# EAGLE design drive_brake (EAGLE 9.5.1)
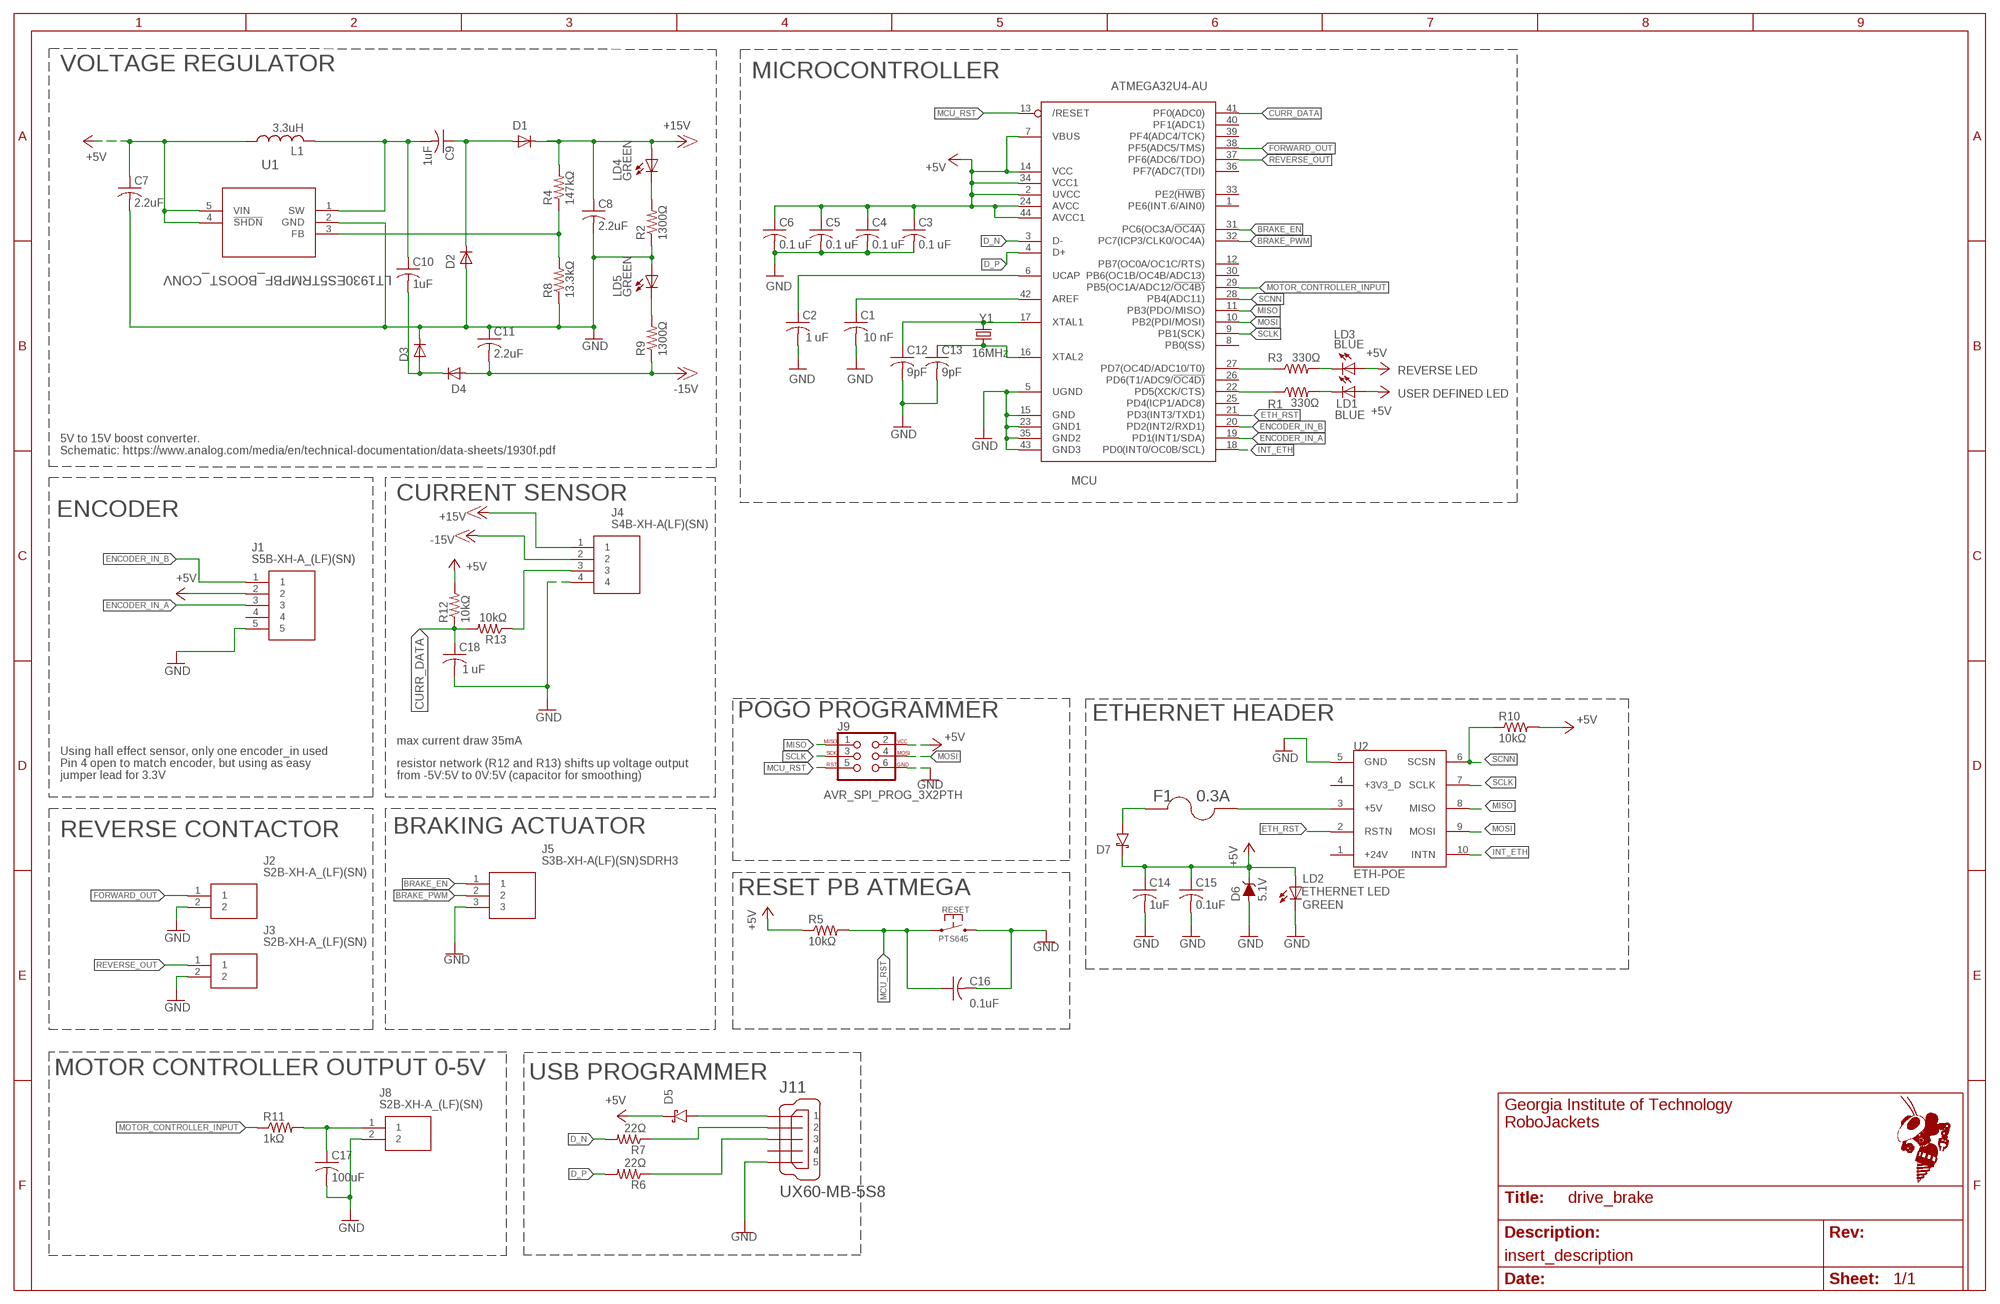
[diagram p0: schematic, sheet 1]
FRAME1 (FRAME_B_L): SCH_DESC: insert_description

## Parts
C1  10 nF  C-USC0603  [C0603]
C2  1 uF  C-USC0603  [C0603]
C3  0.1 uF  C-USC0603  [C0603]
C4  0.1 uF  C-USC0603  [C0603]
C5  0.1 uF  C-USC0603  [C0603]
C6  0.1 uF  C-USC0603  [C0603]
C7  2.2uF  C-USC0805  [C0805]
C8  2.2uF  C-USC1206  [C1206]
C9  1uF  C-USC0603  [C0603]
C10  1uF  C-USC0603  [C0603]
C11  2.2uF  C-USC1206  [C1206]
C12  9pF  C-USC0603  [C0603]
C13  9pF  C-USC0603  [C0603]
C14  1uF  C-USC0603  [C0603]
C15  0.1uF  C-USC0603  [C0603]
C16  0.1uF  C-USC0603  [C0603]
C17  100uF  C-USC1206  [C1206]
C18  1 uF  C-USC0603  [C0603]
D1  DIODE-SOD123  [SOD123]
D2  DIODE-SOD123  [SOD123]
D3  DIODE-SOD123  [SOD123]
D4  DIODE-SOD123  [SOD123]
D5  SCHOTTKYSOD-323  [SOD-323]
D6  5.1V  DIODE-ZENER-MM3Z3V3T1G  [SOD-323]
D7  SCHOTTKYSOD-323  [SOD-323]
F1  0.3A  FUSE1206  [F1206]
J1  S5B-XH-A_(LF)(SN)  [SHDR5W80P0X250_1X5_1490X1150X6]
J2  S2B-XH-A_(LF)(SN)  [SHDR2W80P0X250_1X2_740X1150X61]
J3  S2B-XH-A_(LF)(SN)  [SHDR2W80P0X250_1X2_740X1150X61]
J4  S4B-XH-A(LF)(SN)  [SHDR4W64P0X250_1X4_1240X1155X7]
J5  S3B-XH-A(LF)(SN)SDRH3  [SHDR4]
J8  S2B-XH-A_(LF)(SN)  [SHDR2W80P0X250_1X2_740X1150X61]
J9  AVR_SPI_PROG_3X2PTH  [2X3]
J11  UX60-MB-5S8  [UX60-MB-5S8]
L1  3.3uH  L-USL3225M  [L3225M]
LD1  BLUE  LED0603  [LED-0603]
LD2  GREEN  LED0603  [LED-0603]
LD3  BLUE  LED0603  [LED-0603]
LD4  GREEN  LED0603  [LED-0603]
LD5  GREEN  LED0603  [LED-0603]
MCU  ATMEGA32U4-AU  [TQFP44]
R1  330Ω  RESISTOR0603-RES  [0603-RES]
R2  1300Ω  R-US_R0603  [R0603]
R3  330Ω  RESISTOR0603-RES  [0603-RES]
R4  147kΩ  R-US_R0603  [R0603]
R5  10kΩ  R-US_R0603  [R0603]
R6  22Ω  RESISTOR0603-RES  [0603-RES]
R7  22Ω  RESISTOR0603-RES  [0603-RES]
R8  13.3kΩ  R-US_R0603  [R0603]
R9  1300Ω  R-US_R0603  [R0603]
R10  10kΩ  R-US_R0603  [R0603]
R11  1kΩ  RESISTOR0603-RES  [0603-RES]
R12  10kΩ  RESISTOR0603-RES  [0603-RES]
R13  10kΩ  RESISTOR0603-RES  [0603-RES]
RESET  PTS645  [PTS645]
U1  LT1930ES5TRMPBF_BOOST_CONV  [SOT-5_S]
U2  ETH-POE  [HDRVR10W64P4000X254_2X5_1016X508X254B]
Y1  16MHz  CRYSTAL5X3  [CRYSTAL-SMD-5X3]

## Nets
+5V [vcc]: C3.1 C4.1 C5.1 C6.1 C7.1 C14.1 C15.1 D5.C D6.C D7.C J1.2 J9.2 L1.1 LD1.A LD2.A LD3.A MCU.2(UVCC) MCU.7(VBUS) MCU.14(VCC) MCU.24(AVCC) MCU.34(VCC1) MCU.44(AVCC1) R5.1 R10.2 R12.2 U1.4(!SHDN) U1.5(VIN)
+15V [vcc]: C8.1 D1.C J4.1 LD4.A R4.2
-15V [vcc]: C11.2 D4.A J4.2 R9.1
BRAKE_EN [data]: J5.1 MCU.31(PC6(OC3A/!OC4A))
BRAKE_PWM [data]: J5.2 MCU.32(PC7(ICP3/CLK0/OC4A))
CURR_DATA [data]: C18.1 MCU.41(PF0(ADC0)) R12.1 R13.2
CURR_RAW [data]: J4.3 R13.1
D_N [diff_pair]: MCU.3(D-) R7.2
D_P [diff_pair]: MCU.4(D+) R6.2
ENCODER_IN_A [data]: J1.3 MCU.19(PD1(INT1/SDA))
ENCODER_IN_B [data]: J1.1 MCU.20(PD2(INT2/RXD1))
ETH_RST [data]: MCU.21(PD3(INT3/TXD1)) U2.2(RSTN)
FORWARD_OUT [data]: J2.1 MCU.38(PF5(ADC5/TMS))
GND: C1.2 C2.2 C3.2 C4.2 C5.2 C6.2 C7.2 C8.2 C11.1 C12.2 C13.2 C14.2 C15.2 C16.2 C17.2 C18.2 D2.A D3.C D6.A J1.5 J2.2 J3.2 J4.4 J5.3 J8.2 J9.6 J11.5 LD2.C LD5.A MCU.5(UGND) MCU.15(GND) MCU.23(GND1) MCU.35(GND2) MCU.43(GND3) R2.1 R8.1 RESET.P$3 RESET.P$4 U1.2(GND) U2.5(GND)
INT_ETH [data]: MCU.18(PD0(INT0/OC0B/SCL)) U2.10(INTN)
MCU_RST [data]: C16.1 J9.5 MCU.13(/RESET) R5.2 RESET.P$1 RESET.P$2
MISO [data]: J9.1 MCU.11(PB3(PDO/MISO)) U2.8(MISO)
MOSI [data]: J9.4 MCU.10(PB2(PDI/MOSI)) U2.9(MOSI)
MOTOR_CONTROLLER_INPUT [data]: MCU.29(PB5(OC1A/ADC12/!OC4B)) R11.1
N$1: C1.1 MCU.42(AREF)
N$2: C2.1 MCU.6(UCAP)
N$3: LD3.C R3.2
N$4: F1.2 U2.3(+5V)
N$5: R4.1 R8.2 U1.3(FB)
N$6: C9.2 C10.1 L1.2 U1.1(SW)
N$7: LD1.C R1.2
N$8: C10.2 D3.A D4.C
N$9: D5.A J11.1
N$10: D7.A F1.1
N$11: J11.2 R7.1
N$12: J11.3 R6.1
N$13: C13.1 MCU.16(XTAL2) Y1.1
N$14: LD4.C R2.2
N$15: C12.1 MCU.17(XTAL1) Y1.3
N$16: C9.1 D1.A D2.C
N$17: LD5.C R9.2
N$18: C17.1 J8.1 R11.2
REVERSE_OUT [data]: J3.1 MCU.37(PF6(ADC6/TDO))
SCLK [data]: J9.3 MCU.9(PB1(SCK)) U2.7(SCLK)
SCNN [data]: MCU.28(PB4(ADC11)) R10.1 U2.6(SCSN)
TXLED [data]: MCU.22(PD5(XCK/CTS)) R1.1
TXLED1 [data]: MCU.27(PD7(OC4D/ADC10/T0)) R3.1
Unconnected: J1.4 J11.4 MCU.1(PE6(INT.6/AIN0)) MCU.8(PB0(SS)) MCU.12(PB7(OC0A/OC1C/RTS)) MCU.25(PD4(ICP1/ADC8)) MCU.26(PD6(T1/ADC9/!OC4D)) MCU.30(PB6(OC1B/OC4B/ADC13)) MCU.33(PE2(!HWB)) MCU.36(PF7(ADC7(TDI)) MCU.39(PF4(ADC4/TCK)) MCU.40(PF1(ADC1)) U2.1(+24V) U2.4(+3V3_D)

## Notes on the sheet
- VOLTAGE REGULATOR
- MICROCONTROLLER
- REVERSE LED
- USER DEFINED LED
- 5V to 15V boost converter. 
  Schematic: https://www.analog.com/media/en/technical-documentation/data-sheets/1930f.pdf
- CURRENT SENSOR
- ENCODER
- POGO PROGRAMMER | ETHERNET HEADER
- max current draw 35mA
- Using hall effect sensor, only one encoder_in used
  Pin 4 open to match encoder, but using as easy
  jumper lead for 3.3V
- resistor network (R12 and R13) shifts up voltage output
  from -5V:5V to 0V:5V (capacitor for smoothing)
- REVERSE CONTACTOR | BRAKING ACTUATOR
- RESET PB ATMEGA | ETHERNET LED
- MOTOR CONTROLLER OUTPUT 0-5V | USB PROGRAMMER

## Library data of the parts
C1-C6 C12-C18 = rcl:C-US: CAPACITOR, American symbol; SPICEPREFIX: C
C7 = rcl:C-US: CAPACITOR, American symbol; DKPT: 587-5919-1-ND; SPICEPREFIX: C
C8 C11 = rcl:C-US: CAPACITOR, American symbol; DKPT: 587-5840-1-ND; SPICEPREFIX: C
C9 C10 = rcl:C-US: CAPACITOR, American symbol; DKPT: 311-1445-1-ND; SPICEPREFIX: C
D1-D4 = RoboJackets-Diodes:DIODE-: DIODE; DKPT: MBR0520TPMSCT-ND
D5 = RoboJackets-Diodes:SCHOTTKY; DKPT: B0520WS-FDICT-ND
D6 = SparkFun-DiscreteSemi:DIODE-ZENER: Zener Diode A Zener diode allows current to flow from its anode to its cathode like a normal semiconductor diode, but it also permits current to flow in the reverse direction when its "Zener voltage" is reached. - WIkipedia; PROD_ID: DIO-11284; VALUE: 3.3V
D7 = RoboJackets-Diodes:SCHOTTKY; DKPT: MBRX0520TPMSCT-ND
F1 = RoboJackets-Passive:FUSE; DKPT: F10984CT-ND
J1 = drive_brake:S5B-XH-A_(LF)(SN): JST XH Series, 2.5mm Pitch 5 Way 1 Row Right Angle PCB Header, Through Hole, Solder Termination Source: Datasheet <http://www.jst-mfg.com/product/pdf/eng/eXH.pdf>; DESCRIPTION: JST XH Series, 2.5mm Pitch 5 Way 1 Row Right Angle PCB Header, Through Hole, Solder Termination; HEIGHT: 6.1mm; MANUFACTURER_NAME: JST (JAPAN SOLDERLESS TERMINALS); MANUFACTURER_PART_NUMBER: S5B-XH-A (LF)(SN); RS_PART_NUMBER: 5469072; RS_PRICE-STOCK: http://uk.rs-online.com/web/p/products/5469072
J2 J3 J8 = drive_brake:S2B-XH-A_(LF)(SN): JST (JAPAN SOLDERLESS TERMINALS) - S2B-XH-A (LF)(SN) - CONNECTOR, HEADER, THT, R/A, 2.5MM, 2WAY Source: Datasheet <http://www.jst-mfg.com/product/pdf/eng/eXH.pdf>; DESCRIPTION: JST (JAPAN SOLDERLESS TERMINALS) - S2B-XH-A (LF)(SN) - CONNECTOR, HEADER, THT, R/A, 2.5MM, 2WAY; HEIGHT: 6.1mm; MANUFACTURER_NAME: JST (JAPAN SOLDERLESS TERMINALS); MANUFACTURER_PART_NUMBER: S2B-XH-A (LF)(SN)
J4 = drive_brake:S4B-XH-A(LF)(SN): XH-2.5mm Header side entry 4 way JST XH Series, Series Number S4B, 2.5mm Pitch 4 Way 1 Row Right Angle PCB Header, Solder Termination, 3A Source: Datasheet <http://www.jst-mfg.com/product/pdf/eng/eXH.pdf>; DESCRIPTION: XH-2.5mm Header side entry 4 way JST XH Series, Series Number S4B, 2.5mm Pitch 4 Way 1 Row Right Angle PCB Header, Solder Termination, 3A; HEIGHT: 7mm; MANUFACTURER_NAME: JST (JAPAN SOLDERLESS TERMINALS); MANUFACTURER_PART_NUMBER: S4B-XH-A(LF)(SN); RS_PART_NUMBER: 8201589P; RS_PRICE-STOCK: http://uk.rs-online.com/web/p/products/8201589P
J5 = drive_brake:S3B-XH-A(LF)(SN): XH-2.5mm Header side entry 3 way JST XH Series, Series Number S3B, 2.5mm Pitch 3 Way 1 Row Right Angle PCB Header, Solder Termination, 3A Source: Datasheet <http://www.jst-mfg.com/product/pdf/eng/eXH.pdf>
J9 = SparkFun-Connectors:AVR_SPI_PROG_3X2: AVR ISP 6 Pin This is the reduced ISP connector for AVR programming. Common on Arduino. This footprint will take up less PCB space and can be used with a 10-pin to 6-pin adapter such as SKU: BOB-08508 **Special note about "TEST_POINT" package. The stop mask is on the top side, so if you want your programming test points to be on the bottom of your board, make sure to place this package on the bottom side of the board. This also ensure that the orientation to program from the bottom side will be correct. SparkFun Products: SparkFun ISP Pogo Adapter <https://www.sparkfun.com/products/11591> - NS Tiny AVR Programmer <https://www.sparkfun.com/products/11801> -PTH
J11 = RoboJackets-Connectors:UX60*-MB-5S?: Mini USB Connector Brand: Hirose Electric Co Ltd <http://www.hirose.com/us/> Series: UX <http://www.digikey.com/product-search/en?FV=fff40016,fff802e4,ffec3225> Distributor: Digi-Key <http://www.digikey.com/product-detail/en/UX60A-MB-5ST/H2961CT-ND/597540>; PINS: 5
L1 = rcl:L-US: INDUCTOR, American symbol; DKPT: 535-12564-1-ND; SPICEPREFIX: L
LD1-LD3 = SparkFun:LED: LEDs Standard schematic elements and footprints for 5mm, 3mm, 1206, and 0603 sized LEDs. 5mm - Spark Fun Electronics SKU : COM-00529 (and others)
LD4 LD5 = SparkFun:LED: LEDs Standard schematic elements and footprints for 5mm, 3mm, 1206, and 0603 sized LEDs. 5mm - Spark Fun Electronics SKU : COM-00529 (and others); DKPT: 160-1446-1-ND
MCU = adafruit:ATMEGA32U4: http://www.ladyada.net/library/eagle
R1 R3 R12 R13 = SparkFun:RESISTOR: Resistor Basic schematic elements and footprints for 0603, 1206, and PTH resistors.
R2 R9 = rcl:R-US_: RESISTOR, American symbol; DKPT: RR08P1.3KDCT-ND; SPICEPREFIX: R
R4 = rcl:R-US_: RESISTOR, American symbol; DKPT: 311-147KHRCT-ND; SPICEPREFIX: R
R5 R10 = rcl:R-US_: RESISTOR, American symbol; SPICEPREFIX: R
R6 R7 R11 = SparkFun:RESISTOR: Resistor Basic schematic elements and footprints for 0603, 1206, and PTH resistors.; DKPT: 118-CR0603-FX-22R0ELFCT-ND
R8 = rcl:R-US_: RESISTOR, American symbol; DKPT: RR08P13.3KDCT-ND; SPICEPREFIX: R
RESET = RoboJackets-Switches:PTS645
U1 = drive_brake:LT1930ES5TRMPBF_BOOST_CONV; MANUFACTURER_PART_NUMBER: LT1930ES5#TRMPBF; VENDOR: Linear Technology
U2 = ethernet_poe:ETH-POE: POE
Y1 = SparkFun:CRYSTAL: Crystals Various standard crystals. Proven footprints. Spark Fun Electronics SKU : COM-00534

## Net classes
0 default: width 0.25 mm, drill 0.35 mm
1 vcc: width 0.3 mm
2 diff_pair: width 0.25 mm
3 data: width 0.25 mm

## Board
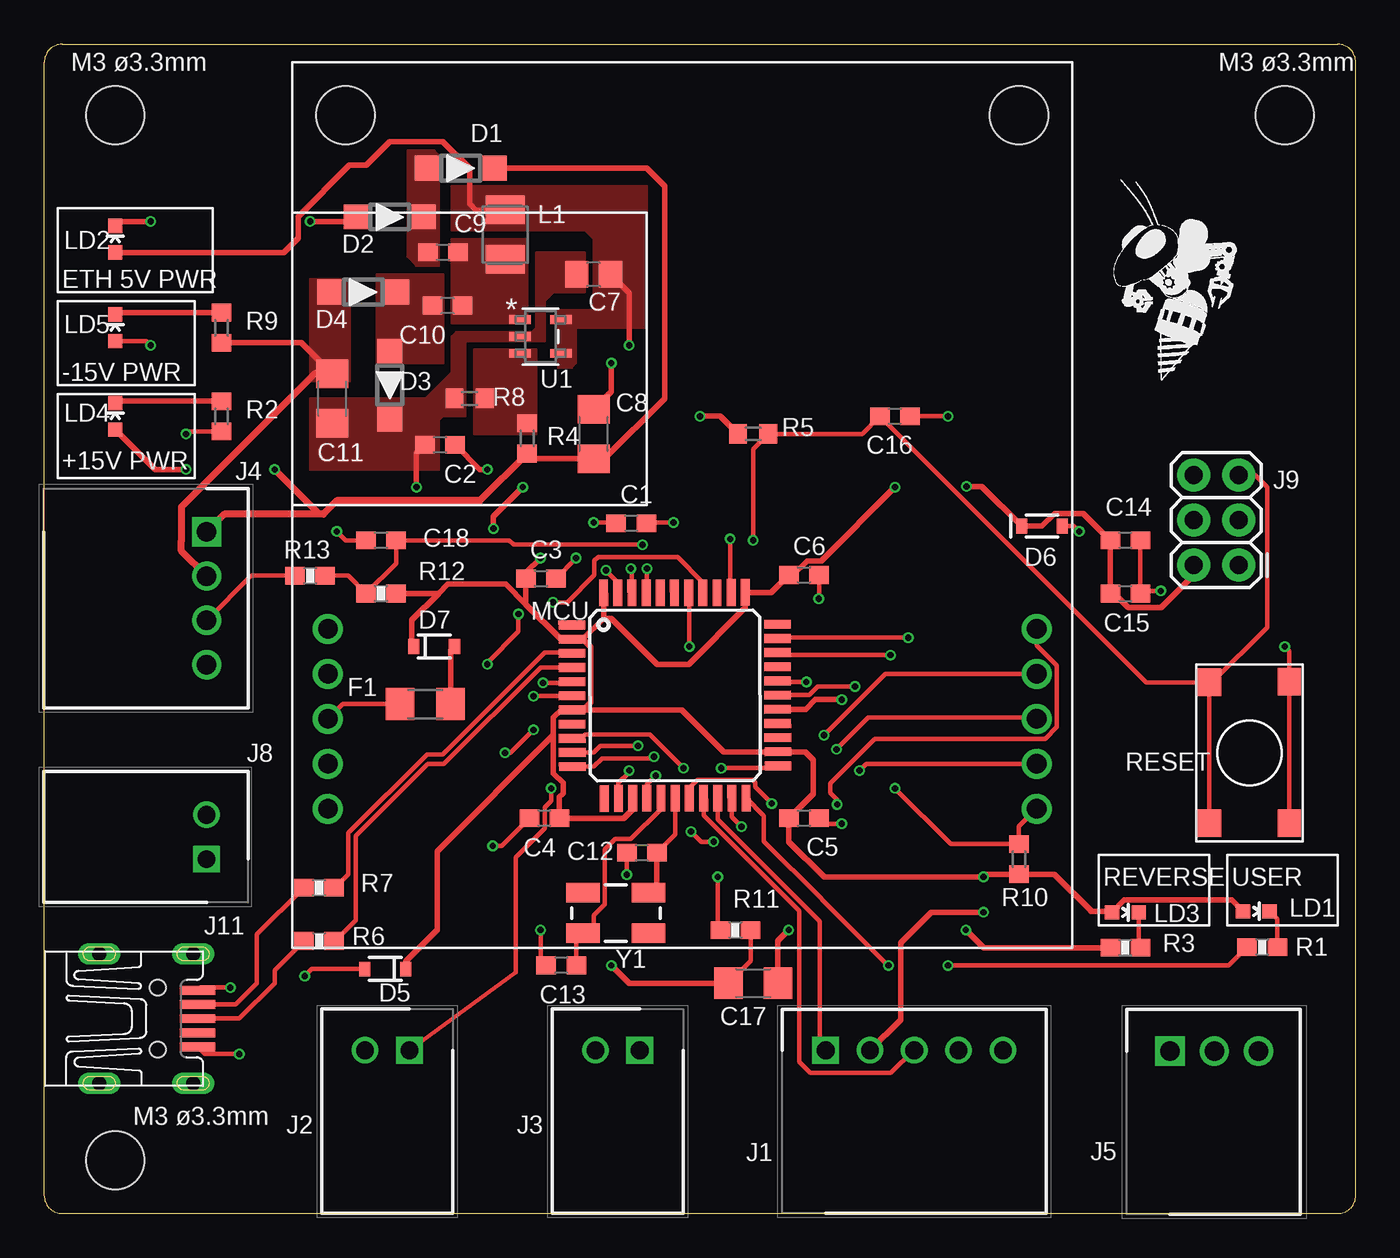
[diagram p1: board, top side]
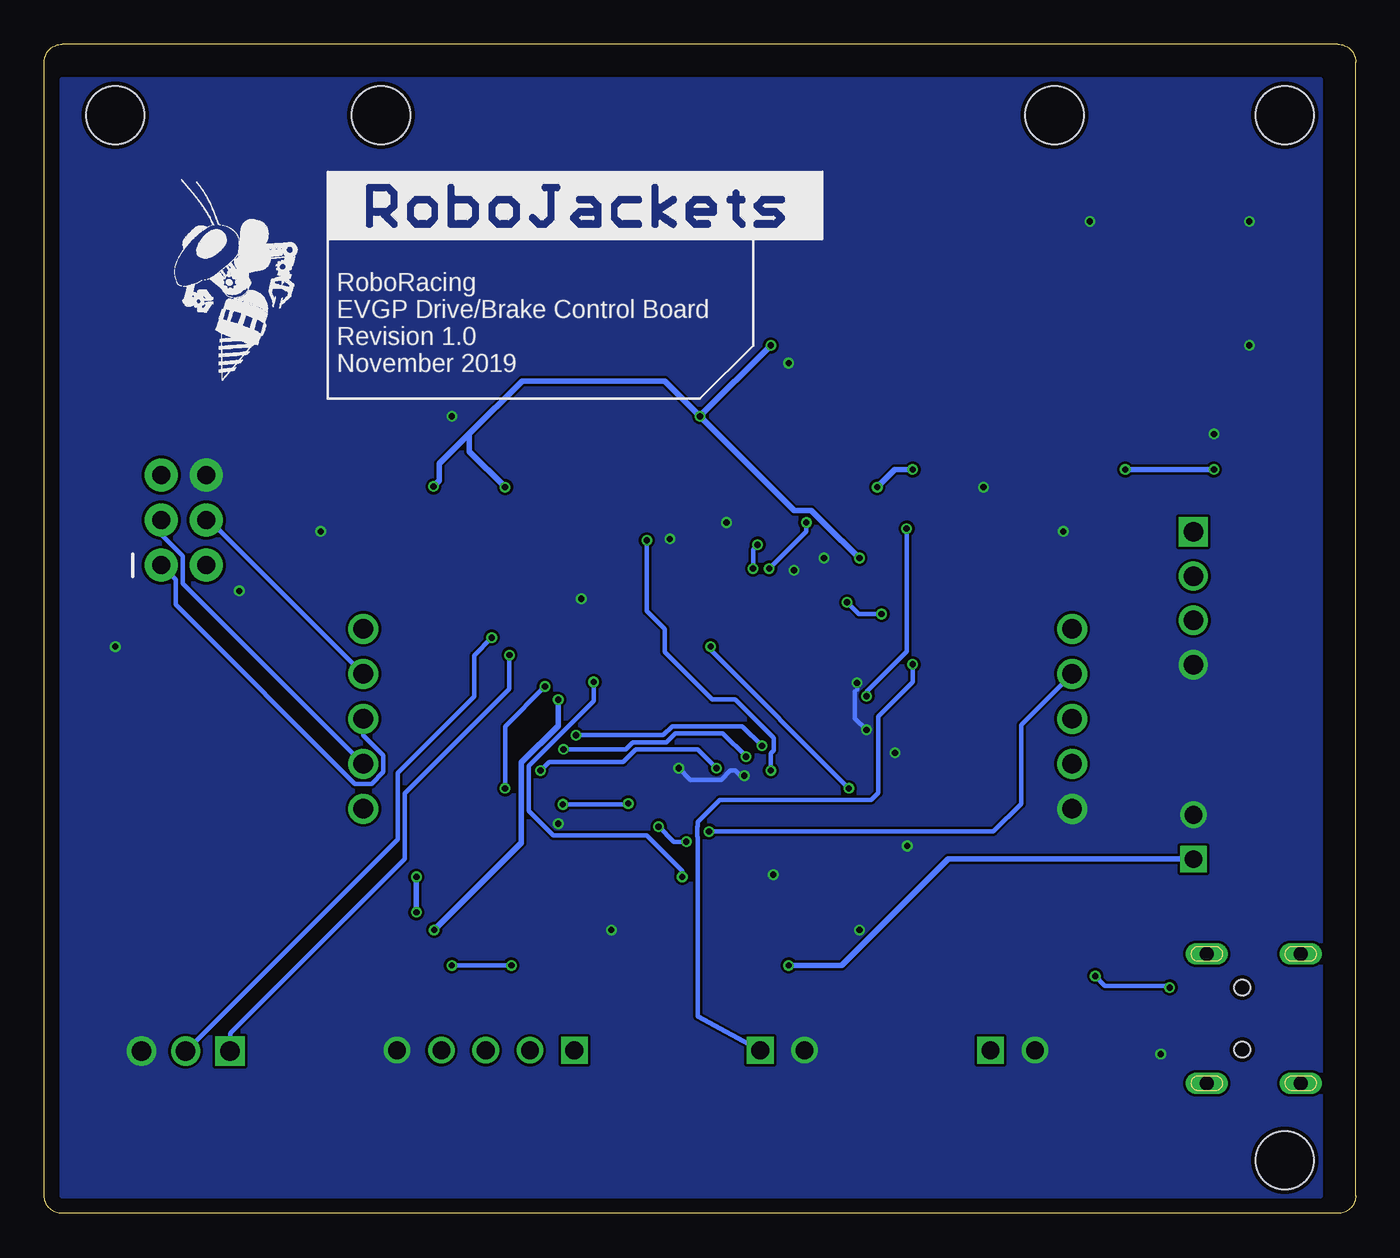
[diagram p2: board, bottom side, seen from below]

Size 74 x 66 mm. Coordinates in mm from the lower left corner, seen from the top.
Outline: 1,0 73,0 arc90 74,1 74,65 arc90 73,66 1,66 arc90 0,65 0,1 arc90 1,0
Copper layers (1*16): Top 0.018mm / dielectric 1.55mm / Bottom 0.018mm
Design rules "eC_2Layer_PClass6_BaseCopperO18_eCDefault": minimum track width 0.15mm, minimum drill 0.35mm, track to track 0.15mm, track to pad 0.15mm, pad to pad 0.15mm, via to via 0.15mm, smd to smd 0mil, copper to edge 0.25mm, drill to drill 0.35mm, minimum pad ring 0.175mm, minimum via ring 0.125mm, stop-mask expansion 0mil, vias tented up to drill 0.45mm, thermal gap 0.2mm
Holes 3.3 mm at 4,62 70,62 4,3

### Footprints (pad centres in the part's own frame; a part is rotated, then mirrored left to right if it is on the bottom)
C0603 = smd 1.1 x 1: 1 -0.85,0; 2 0.85,0
C0805 = smd 1.3 x 1.5: 1 -0.95,0; 2 0.95,0
C1206 = smd 1.6 x 1.8: 1 -1.4,0; 2 1.4,0
SOD123 = smd 1.4 x 1.4: A 1.9,0; C -1.9,0
SOD-323 = smd 0.63 x 0.83: A 1.15,0; C -1.15,0
F1206 = smd 1.6 x 1.803: 1 -1.422,0; 2 1.422,0
SHDR5W80P0X250_1X5_1490X1150X6 = drill 1 pad 1.5 square: 1 0,0 | drill 1 pad 1.5: 2 2.5,0; 3 5,0; 4 7.5,0; 5 10,0
SHDR2W80P0X250_1X2_740X1150X61 = drill 1 pad 1.5 square: 1 0,0 | drill 1 pad 1.5: 2 2.5,0
SHDR4W64P0X250_1X4_1240X1155X7 = drill 1.1 pad 1.65 square: 1 0,0 | drill 1.1 pad 1.65: 2 2.5,0; 3 5,0; 4 7.5,0
SHDR4 = drill 1.1 pad 1.65 square: 1 0,0 | drill 1.1 pad 1.65: 2 2.5,0; 3 5,0
2X3 = drill 1.016 pad 1.88: 1 0,0; 2 0,2.54; 3 2.54,0; 4 2.54,2.54; 5 5.08,0; 6 5.08,2.54
UX60-MB-5S8 = smd 2 x 0.5: 1 8.65,1.6; 2 8.65,0.8; 3 8.65,0; 4 8.65,-0.8; 5 8.65,-1.6 | drill 0.8 long: M1 3.1,-3.65; M2 3.1,3.65; M3 8.4,3.65; M4 8.4,-3.65 | hole 0.9: 6.4,-1.75; 6.4,1.75
L3225M = smd 1.6 x 2.2: 1 -1.4,0; 2 1.4,0
LED-0603 = smd 0.8 x 0.8: A 0,-0.75; C 0,0.75
TQFP44 = smd 1.5 x 0.5: 1 -5.8,4; 2 -5.8,3.2; 3 -5.8,2.4; 4 -5.8,1.6; 5 -5.8,0.8; 6 -5.8,0; 7 -5.8,-0.8; 8 -5.8,-1.6; 9 -5.8,-2.4; 10 -5.8,-3.2; 11 -5.8,-4; 23 5.8,-4; 24 5.8,-3.2; 25 5.8,-2.4; 26 5.8,-1.6; 27 5.8,-0.8; 28 5.8,0; 29 5.8,0.8; 30 5.8,1.6; 31 5.8,2.4; 32 5.8,3.2; 33 5.8,4 | smd 0.5 x 1.5: 12 -4,-5.8; 13 -3.2,-5.8; 14 -2.4,-5.8; 15 -1.6,-5.8; 16 -0.8,-5.8; 17 0,-5.8; 18 0.8,-5.8; 19 1.6,-5.8; 20 2.4,-5.8; 21 3.2,-5.8; 22 4,-5.8; 34 4,5.8; 35 3.2,5.8; 36 2.4,5.8; 37 1.6,5.8; 38 0.8,5.8; 39 0,5.8; 40 -0.8,5.8; 41 -1.6,5.8; 42 -2.4,5.8; 43 -3.2,5.8; 44 -4,5.8
0603-RES = smd 1.1 x 1: 1 -0.85,0; 2 0.85,0
R0603 = smd 1 x 1.1: 1 -0.85,0; 2 0.85,0
PTS645 = smd 1.55 x 1.3: P$1 -3.975,2.25; P$2 3.975,2.25; P$3 -3.975,-2.25; P$4 4.025,-2.25
SOT-5_S = smd 1.211 x 0.501: 1 -1.15,0.95; 2 -1.15,0; 3 -1.15,-0.95; 4 1.15,-0.95; 5 1.15,0.95
HDRVR10W64P4000X254_2X5_1016X508X254B = drill 1.105 pad 1.705: 1 2,18; 2 2,15.46; 3 2,12.92; 4 2,10.38; 5 2,7.84; 6 42,7.84; 7 42,10.38; 8 42,12.92; 9 42,15.46; 10 42,18 | hole 3.3: 3,47; 41,47
CRYSTAL-SMD-5X3 = smd 1.9 x 1.1: 1 -1.85,-1.15; 2 1.85,-1.15; 3 1.85,1.15; 4 -1.85,1.15

### Placement (x,y rotation side)
C1  33.12,38.96 0 top
C2  22.33,43.39 180 top
C3  28.03,35.84 0 top
C4  28.22,22.31 180 top
C5  42.87,22.31 0 top
C6  42.87,36.04 0 top
C7  31,53 180 top
C8  31,44 90 top
C9  22.5,54.25 0 top
C10  22.75,51.25 180 top
C11  16.25,46 90 top
C12  33.72,20.36 180 top
C13  29.17,14.01 180 top
C14  61,38 0 top
C15  61,35 0 top
C16  48,45 0 top
C17  40,13 0 top
C18  19,38 180 top
D1  23.5,59 180 top
D2  19.5,56.25 180 top
D3  19.5,46.75 90 top
D4  18,52 180 top
D5  19.24,13.8 180 top
D6  56.3,38.8 0 top
D7  22,32 0 top
E$3  [ROBOBUZZ_0.6X]  64,47 0 bottom
F1  21.5,28.75 180 top
J1  44.09,9.21 0 top
J2  20.6,9.21 180 top
J3  33.6,9.21 180 top
J4  9.16,38.48 270 top
J5  63.52,9.16 0 top
J8  9.16,20 90 top
J9  67.4,36.6 90 top
J11  0,11 0 top
L1  26,55.25 270 top
LD1  68.39,17.06 270 top
LD2  4,55 0 top
LD3  61,17 270 top
LD4  4,45 0 top
LD5  4,50 0 top
MCU  35.58,29.24 0.2 top
R1  68.73,15.04 0 top
R2  10,45 90 top
R3  61,15 0 top
R4  27.25,43.75 270 top
R5  40,44 0 top
R6  15.51,15.39 0 top
R7  15.5,18.39 0 top
R8  24,46 0 top
R9  10,50 90 top
R10  55,20 270 top
R11  39,16 0 top
R12  19,35 0 top
R13  15,36 0 top
RESET  68,26 90 top
ROBORACING  [ROBOJACKETS]  58,55 0 bottom
U1  28,49.5 0 top
U2  14,15 0 top
U$1  [ROBOBUZZ_0.6X]  63,47 0 top
Y1  32.25,16.96 0 top

### Tracks (layer width: path | path; a pad name or v marks a point on that pad's centre or on a via)
+5V  (via drill 0.35)
  Top 0.3: MCU.2 29.14,32.41 27.18,34.38 | 27.18,34.38 C3.1 27.18,36.18 v28,37 | v52.04,41.04 52.91,41.04 D6.C 56.29,38.8 57.01,39.52 58.63,39.52 C14.1 C15.1 60.37,35 61.17,34.2 63.02,34.2 64.86,36.04 J9.2 | J1.2 48.32,10.94 48.32,15.28 50.04,17 v53,17 | MCU.7 29.16,28.42 28.73,27.99 28.73,27 | 28.73,27 28.73,24.85 29.28,24.3 29.28,23.72 29.07,23.51 C4.1 32.71,22.31 33.2,22.8 MCU.14 | 28.73,27 22.17,20.44 22.17,16 20.39,14.22 D5.C | MCU.7 30.4,28.42 30.83,28.85 30.83,31.99 30.4,32.42 MCU.2 | MCU.2 30.39,32.42 31.56,33.59 | 31.56,33.59 MCU.44 | MCU.7 35.98,28.42 38.34,26.05 MCU.24 42.94,26.06 43.4,25.6 43.4,23.69 C5.1 42.02,20.98 44,19 v53,19 53.15,19.15 R10.2 57,19.15 59.05,17.1 59.05,17.05 60.2,17.05 LD3.A 60.95,17.7 67,17.7 LD1.A | 31.56,33.59 32,33.59 34.59,31 36.36,31 39.56,34.2 MCU.34 41.03,35.05 C6.1 42.24,36.04 43.05,36.84 43.84,36.84 v48,41 | L1.1 24.35,56.65 24,57 24,59 22.49,60.51 19.49,60.51 18.17,59.18 17.22,59.18 14.32,56.28 14.32,55.07 13.5,54.25 LD2.A | C7.1 33,51.95 v33,49 | 27.18,34.38 26.04,35.52 22.77,35.52 22.25,35 | 22.25,35 20.75,33.5 20.75,32.1 D7.C | v37,45 38.15,45 R5.1 | 22.25,35 R12.2
  Bottom 0.3: v52.04,41.04 51.72,41.36 51.72,42.32 50.02,44.02 | 50.02,44.02 47.04,47 39,47 v37,45 | v53,17 v53,19 | v28,37 29,38 29.04,38 30.72,39.68 31.68,39.68 v37,45 | v48,41 50.02,43.02 50.02,44.02 | v33,49 v37,45
  pour Top (no thermals): 29,51 29,50 34,50 34,58 23,58 23,55.5 30.5,55.5 31,55 31,51
  pour Top (no thermals): 29,50.5 29,47.75 29.75,47.75 30,48 30,50.5
+15V  (via drill 0.35)
  Top 0.3: R4.2 27.55,42.6 C8.1 31.6,42.6 35,46 35,58 34,59 D1.C | LD4.A 6.25,42 v8,42 | 15.73,39.5 15.75,39.48
  Top 0.4: J4.1 10.16,39.48 15.75,39.48 16.5,40.23 24.58,40.23 R4.2 | v13,42 15.5,39.5 15.73,39.5
  Bottom 0.3: v8,42 v13,42
-15V
  Top 0.3: R9.1 14.5,49.15 C11.2
  Top 0.4: J4.2 7.73,37.41 7.73,37.98 7.73,39.88 15.25,47.4 C11.2
  pour Top (no thermals): 15,52.75 15,47 17.25,47 17.25,52.75
BRAKE_EN  (via drill 0.35)
  Top 0.25: v47.75,31.52 41.51,31.52 MCU.31
  Bottom 0.25: J5.1 63.52,10.16 53.66,20.02 53.66,23.71 47.75,29.62 v47.75,31.52
BRAKE_PWM  (via drill 0.35)
  Top 0.25: v48.75,32.5 41.41,32.5 MCU.32
  Bottom 0.25: J5.2 54.06,21.12 54.06,24.88 49.75,29.19 49.75,31.5 v48.75,32.5
CURR_DATA  (via drill 0.35)
  Top 0.25: v33.75,37.75 26.5,37.75 26.25,38 C18.1 19.85,36.7 R12.1 17.15,36 R13.2 | v34.01,36.4 34.01,35.08 MCU.41
  Bottom 0.25: v33.75,37.75 34.01,37.49 v34.01,36.4
CURR_RAW
  Top 0.25: J4.3 11.68,36 R13.1
D_N
  Top 0.25: R7.2 16.4,18.39 17.16,19.15 17.16,21.47 21.59,25.91 22.49,25.91 28.25,31.67 29.72,31.67 MCU.3 | MCU.3
D_P
  Top 0.25: R6.2 16.41,15.39 17.56,16.54 17.56,21.3 21.63,25.37 22.55,25.37 28,30.82 MCU.4
ENCODER_IN_A
  Top 0.25: MCU.19 37.2,22.48 42.6,17.08 42.6,8.55 43.22,7.93 47.77,7.93 49.05,9.21 J1.3
ENCODER_IN_B
  Top 0.25: J1.1 43.75,9.55 43.75,16.5 38,22.25 MCU.20 | MCU.20
ETH_RST  (via drill 0.35)
  Top 0.25: v36.49,21.56 37.07,20.98 v37.77,20.98 | v39.34,21.84 38.8,22.38 MCU.21
  Bottom 0.25: v37.77,20.98 38.48,20.98 v39.34,21.84 | v36.49,21.56 20.44,21.56 18.88,23.12 18.88,27.58 U2.2
FORWARD_OUT  (via drill 0.35)
  Top 0.25: v28.6,24 28.6,23.28 28.24,22.93 28.24,21.74 26.6,20.1 26.6,13.6 J2.1 | v36.4,32 36.4,35 MCU.38
  Bottom 0.25: v28.6,24 36.4,31.8 v36.4,32
GND  (via drill 0.35)
  Top 0.25: C16.2 v51,45 | D6.A 58.1,38.8 v58.4,38.5 | v63,35.14 61.99,35.14 C15.2 C14.2 | C5.2 44.03,22 v45,22 | MCU.23 41.27,25.14 v38.2,25.14 | MCU.15 34,24.22 v34.5,24.72 | C6.2 43.72,34.72 v43.7,34.7 | v38.7,38.08 38.7,35.11 MCU.35 | C1.2 34.01,39 v35.5,39 | C3.2 30,36.96 v30,37 | MCU.43 32.34,35.05 32.33,35.65 31.92,36.05 31.7,36.28 v31.7,36.31 | MCU.5 29.71,29.95 v28.14,29.95 | v27.6,27.3 26.3,26 v26,26 | v25.3,20.75 25.81,20.75 C4.2 | C12.2 v32.87,19.13 | v32.87,19.13 | v70,32 70.25,31.75 RESET.P$4 RESET.P$3 | C13.2 28,14.33 v28,16 | J11.5 9.05,9 v11,9 | R2.1 8.15,44.15 v8,44 | LD5.A 5.75,49.25 v6,49 | C18.2 17,38 v16.5,38.5
  Top 0.3: C2.2 21,42.91 v21,41 | D2.A 17.35,56 v15,56 | C8.2 32,46.4 v32,48 | LD2.C 4.25,56 v6,56 | C17.2 41.4,15.4 v42,16
  Bottom 0.25: v38.2,25.14 37.54,24.48 35.8,24.48 35.28,25 35,25 34.72,24.72 v34.5,24.72 | v28.14,29.95 28.14,29.59 28.26,29.47 28.26,27.96 v27.6,27.3
  pour Bottom (no thermals): 2,64 2,1 73,1 73,64
  pour Top (no thermals): 15,46 15,42 22.25,42 22.25,44.75 22.5,45 23.75,45 23.75,49 23.75,49.25 28.25,49.25 28.25,51.5 28.5,51.75 28.75,52 30.5,52 30.5,54.25 27.75,54.25 27.75,50 27.5,49.75 23.25,49.75 23,49.5 23,49.25 23,47.5 21.5,46
INT_ETH  (via drill 0.35)
  Top 0.25: MCU.18 36.42,23.46 36.42,24.06 36.84,24.48 39.96,24.48 40.12,24.32 40.12,24.07 v41.05,23.14 | U2.10 56,32.06 57.13,30.93 57.13,27.45 56.47,26.79 46.86,26.79 44.34,24.27 44.34,23.73 44.74,23.33 v44.74,23.09
  Bottom 0.25: v44.74,23.09 41.1,23.09 v41.05,23.14
MCU_RST  (via drill 0.35)
  Top 0.25: v40,38 40,43.15 R5.2 46.15,44 C16.1 62.17,29.98 RESET.P$2 | v33,25 33,24.9 32.4,24.3 MCU.13 | MCU.13 | J9.5 68.32,41.68 69,41 69,33.09 65.89,29.98 RESET.P$2 | RESET.P$2 RESET.P$1
  Bottom 0.25: v40,38 40,34 39,33 39,31.7 36.3,29 35,29 32.84,26.84 32.84,26.12 33,25.97 v33,25
MISO  (via drill 0.35)
  Top 0.25: v34.4,25.79 34.31,25.69 31.47,25.69 31,25.22 MCU.11 | v44.7,26.2 46.5,28 55.92,28 U2.8
  Bottom 0.25: v44.7,26.2 41.2,26.2 40.8,26.6 38.9,26.6 38.4,27.1 35.71,27.1 v34.4,25.79 | J9.1 66.58,35.78 66.58,34.37 56.47,24.25 55.53,24.25 54.87,24.91 54.87,25.85 56,26.98 U2.8
MOSI  (via drill 0.35)
  Top 0.25: MCU.10 31,26.02 31.38,26.39 v33.5,26.39 | v44,27 47.46,30.46 U2.9
  Bottom 0.25: v33.5,26.39 34.6,27.5 38.57,27.5 39.07,27 v44,27 | U2.9 64.68,39.14 J9.4
MOTOR_CONTROLLER_INPUT  (via drill 0.35)
  Top 0.25: v43,30 41.44,30 MCU.29 | v38,19 38,16.15 R11.1
  Bottom 0.25: v43,30 43,28.93 46.66,25.27 46.66,22.73 45.27,21.34 40,21.34 38,19.34 v38,19
N$1  (via drill 0.35)
  Top 0.25: MCU.42 33.16,36.34 v33.1,36.4 | v31,39 32.23,39 C1.1
  Bottom 0.25: v33.1,36.4 31,38.5 v31,39
N$2  (via drill 0.35)
  Top 0.25: v27.6,29.2 29.76,29.2 MCU.6
  Top 0.3: v27,41 25.34,39.34 v25.34,38.66 | v25,42 24.57,42 C2.1
  Bottom 0.25: v27.6,29.2 27.6,29.47 25.34,31.73 v25.34,38.66
  Bottom 0.3: v27,41 26,42 v25,42
N$3
  Top 0.25: R3.2 61.75,15.1 LD3.C
N$4
  Top 0.25: F1.2 16.83,28.75 U2.3
N$5
  pour Top (no thermals): 27.75,44 24.25,44 24.25,48.75 27.75,48.75
N$6
  pour Top (no thermals): 23,55 23,50.25 27.25,50.25 27.25,55
N$7
  Top 0.25: LD1.C 69.58,16.62 R1.2
N$8
  pour Top (no thermals): 18.75,49.25 18.75,48 22.5,48 22.5,53 18.75,53
N$9  (via drill 0.35)
  Top 0.25: v14.7,13.4 15.1,13.8 D5.A | v10.5,12.75 8.8,12.75 J11.1
  Bottom 0.25: v14.7,13.4 14.15,12.85 10.6,12.85 v10.5,12.75
N$10
  Top 0.3: F1.1 22.92,31.77 D7.A
N$11
  Top 0.25: R7.1 12,15.74 12,13 10.8,11.8 J11.2
N$12
  Top 0.25: R6.1 13,13.73 13,13 11,11 J11.3
N$13
  Top 0.25: C13.1 30.02,15.43 Y1.1 30.81,15.81 31,16 31,16.82 31.63,17.45 31.63,20.56 32.2,21.14 33.1,21.14 34.78,22.82 34.78,23.42 MCU.16
N$14
  Top 0.3: R2.2 4.1,45.85 LD4.C
N$15
  Top 0.25: C12.1 35.6,21.39 MCU.17
  Top 0.3: C12.1 34.57,18.58 Y1.3
N$16
  pour Top (no thermals): 22,60 20.5,60 20.5,54 21,53.5 22.25,53.5 22.25,59.75
N$17
  Top 0.3: R9.2 4.1,50.85 LD5.C
N$18  (via drill 0.35)
  Top 0.25: R11.2 39.85,14.25 C17.1
  Top 0.3: C17.1 33,13 v32,14
  Bottom 0.3: v32,14 29,14 23,20 J8.1
REVERSE_OUT  (via drill 0.35)
  Top 0.25: MCU.37 37.14,35.07 37.14,35.66 35.74,37.06 31.26,37.06 31.04,36.84 31.04,36.04 29.5,34.5 v28.7,34.5 | v26.75,33.84 26.75,32.84 25,31.09 v25,31
  Bottom 0.25: v28.7,34.5 28.04,33.84 v26.75,33.84 | v25,31 25,30 26.94,28.06 26.94,23.73 27.33,23.34 35.88,23.34 37.11,22.11 37.11,21.86 37.15,21.83 37.15,21.29 37.11,21.25 37.11,11.11 J3.1
SCLK  (via drill 0.35)
  Top 0.25: MCU.9 30.29,26.82 30.52,27.05 34.16,27.05 v36.07,25.14 | v46,25 46.38,25.38 U2.7
  Bottom 0.25: v36.07,25.14 37.13,26.2 40.64,26.2 41.33,25.5 45.5,25.5 v46,25 | J9.3 67.4,38.32 66.18,37.1 66.18,35.56 U2.7
SCNN  (via drill 0.35)
  Top 0.25: U2.6 55,21.84 R10.1 51.15,20.85 v48,24 | v45.75,29.75 43.65,29.75 43.16,29.26 MCU.28
  Bottom 0.25: v48,24 48,27.5 v45.75,29.75
TXLED  (via drill 0.35)
  Top 0.25: MCU.22 40.6,22.45 40.6,21 43.8,17.8 43.94,17.66 47.6,14 v47.64,14 | v51,14 66.84,14 R1.1
  Bottom 0.25: v47.64,14 v51,14
TXLED1  (via drill 0.35)
  Top 0.3: R3.1 53,15 v52,16 | v45,29 43.5,29 42.96,28.46 MCU.27
  Bottom 0.3: v45,29 45,27.53 47.08,25.45 47.08,20.92 v52,16

### Text on the board
bPlace: RoboRacing / EVGP Drive/Brake Control Board / Revision 1.0 / November 2019
tNames: M3 ø3.3mm | M3 ø3.3mm | ETH 5V PWR | -15V PWR | +15V PWR | RESET | REVERSE | USER | M3 ø3.3mm